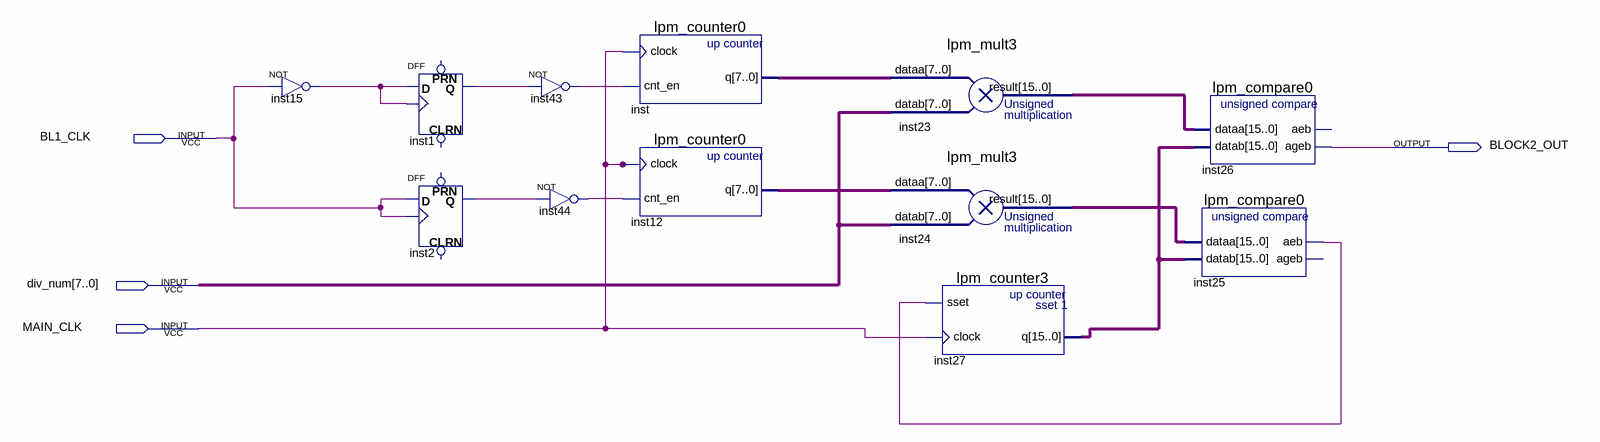
[diagram p0: schematic sheet]
// Quartus schematic BLOCK_2.bdf as structural Verilog: 12 symbols, 4 pins
module BLOCK_2 (
  input  BL1_CLK,
  input  [7:0] div_num,
  input  MAIN_CLK,
  output BLOCK2_OUT
);

  wire inst1_q, inst2_q, inst15_out, inst25_aeb, inst43_out, inst44_out;
  wire [7:0] inst12_q, inst_q;
  wire [15:0] inst23_result, inst24_result, inst27_q;

  not inst15 (inst15_out, BL1_CLK);
  DFF inst1 (.CLK(inst15_out), .D(inst15_out), .Q(inst1_q));  // open: CLRN, PRN
  DFF inst2 (.CLK(BL1_CLK), .D(BL1_CLK), .Q(inst2_q));  // open: CLRN, PRN
  not inst43 (inst43_out, inst1_q);
  not inst44 (inst44_out, inst2_q);
  lpm_counter0 inst (.clock(MAIN_CLK), .cnt_en(inst43_out), .q(inst_q));
  lpm_counter0 inst12 (.clock(MAIN_CLK), .cnt_en(inst44_out), .q(inst12_q));
  lpm_mult3 inst23 (.dataa(inst_q), .datab(div_num), .result(inst23_result));
  lpm_mult3 inst24 (.dataa(inst12_q), .datab(div_num), .result(inst24_result));
  lpm_counter3 inst27 (.sset(inst25_aeb), .clock(MAIN_CLK), .q(inst27_q));
  lpm_compare0 inst26 (.dataa(inst23_result), .datab(inst27_q), .ageb(BLOCK2_OUT));  // open: aeb
  lpm_compare0 inst25 (.dataa(inst24_result), .datab(inst27_q), .aeb(inst25_aeb));  // open: ageb
endmodule
